# EasyEDA Pro project ProDoc_ChisFlash-MBC5-MAX-v1.22-R0603_32M..epro

# Schematic ChisFlash-MBC5-MAX-v1.22-0603电阻版
Board Name: ChisFlash-MBC5-MAX-v1.22-0603电阻; Create Date: 2025-04-26; Page Name: 1; Project Name: ChisFlash-MBC5（GBC烧录卡）2; Schematic Name: ChisFlash-MBC5-MAX-v1.22_1; Update Date: 2025-06-14; Company: 嘉立创EDA; Page Size: A4; Version: V1.0
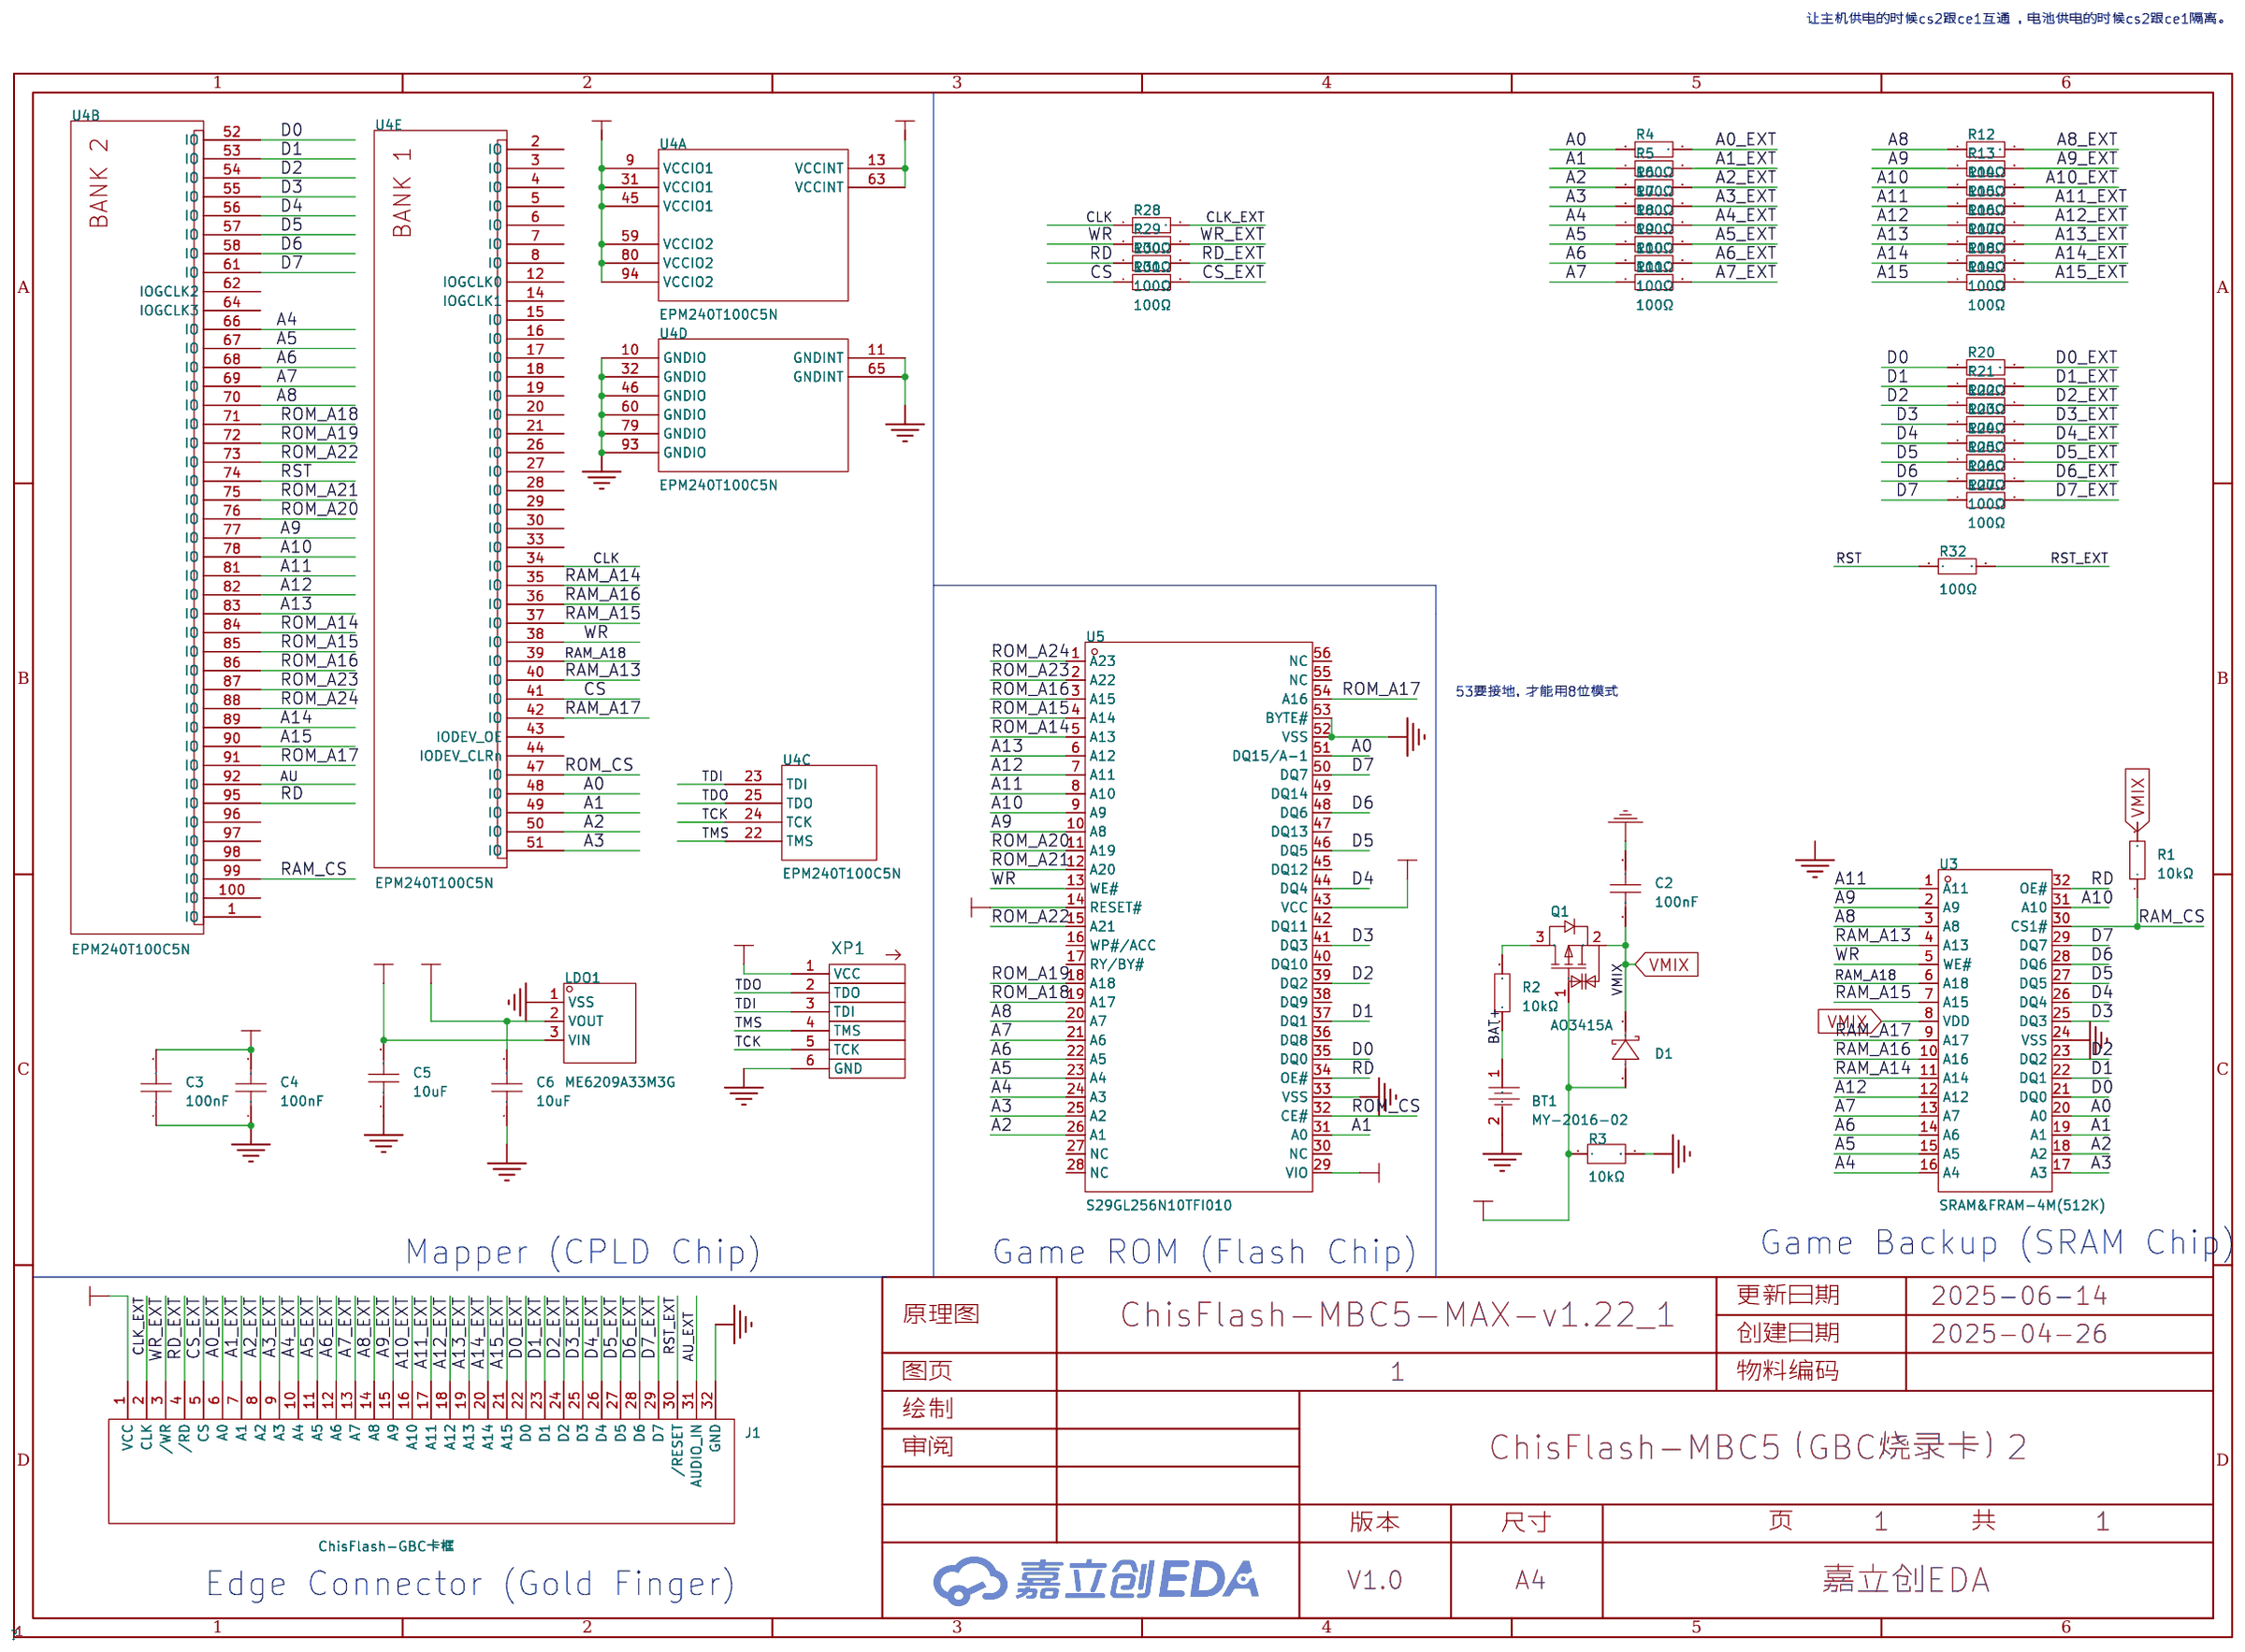
[diagram p0: schematic sheet]

## Parts
BT1  MY-2016-02  [BAT-SMD_MY-2032-08]
C2  100nF  [C0603]
C3  100nF  [C0603]
C4  100nF  [C0603]
C5  10uF  [C0603]
C6  10uF  [C0603]
D1  RB751V-40  [SOD-323_L1.7-W1.3-LS2.6-RD-1]
J1  ChisFlash-GBC卡框  [ChisFlash-GBC卡框]
LDO1  ME6209A33M3G  [SOT-23-3_L2.9-W1.6-P1.90-LS2.8-BR]
Q1  AO3415A  [SOT-23-3_L3.0-W1.7-P0.95-LS2.9-BR]
R1  10kΩ  [R0603]
R2  10kΩ  [R0603]
R3  10kΩ  [R0603]
R4  100Ω  [R01005]
R5  100Ω  [R01005]
R6  100Ω  [R01005]
R7  100Ω  [R01005]
R8  100Ω  [R01005]
R9  100Ω  [R01005]
R10  100Ω  [R01005]
R11  100Ω  [R01005]
R12  100Ω  [R01005]
R13  100Ω  [R01005]
R14  100Ω  [R01005]
R15  100Ω  [R01005]
R16  100Ω  [R01005]
R17  100Ω  [R01005]
R18  100Ω  [R01005]
R19  100Ω  [R01005]
R20  100Ω  [R01005]
R21  100Ω  [R01005]
R22  100Ω  [R01005]
R23  100Ω  [R01005]
R24  100Ω  [R01005]
R25  100Ω  [R01005]
R26  100Ω  [R01005]
R27  100Ω  [R01005]
R28  100Ω  [R01005]
R29  100Ω  [R01005]
R30  100Ω  [R01005]
R31  100Ω  [R01005]
R32  100Ω  [R01005]
U3  SRAM&FRAM-4M(512K)  [TSSOP-TSOP二合一_1]
U4  EPM240T100C5N  [TQFP-100_L14.0-W14.0-P0.50-LS16.0-BL]  (sections 1,2,3,4,5)
U5  S29GL256N10TFI010  [TSOP-56_L18.4-W14.0-P0.50-LS20.0-TL]
XP1  JTAG  [HDR-TH_6P-P1.27-V-M-1]  (no BOM)

## Library data of the parts
BT1 = MY-2016-02: 连接器类型:电池扣;适用电池规格:CR2016;触头材质:磷青铜;触点电镀:镍;工作温度范围:-25℃~+85℃;; LCSC Part Name: 电池扣 适用电池:CR2016; Supplier Part: C2979176; Manufacturer: MYOUNG(美阳); Supplier Footprint: SMD; JLCPCB Part Class: Extended Part; Datasheet: https://atta.szlcsc.com/upload/public/pdf/source/20220302/E5D3505CBEA02A6D68587A503653AA7C.pdf; Supplier: LCSC; Connector Type: 电池扣; Battery Type: CR2016; Contact Material: 磷青铜; Contact Plating: 镍; Operating Temperature Range: -25℃~+85℃
C2-C4 = CGA0603X7R104K500JT: 容值:100nF;精度:±10%;额定电压:50V;材质(温度系数):X7R;; LCSC Part Name: 100nF ±10% 50V; Supplier Part: C6119867; Manufacturer: HRE(芯声); Supplier Footprint: 0603; JLCPCB Part Class: Extended Part; Supplier: LCSC; Tolerance: ±10%; Voltage Rated: 50V; Temperature Coefficient: X7R
C5 C6 = CL10A106MA8NRNC: 容值:10uF;精度:±20%;额定电压:25V;材质(温度系数):X5R;; LCSC Part Name: 10uF ±20% 25V; Supplier Part: C96446; Manufacturer: SAMSUNG(三星); Supplier Footprint: 0603; JLCPCB Part Class: 基础库; Datasheet: https://atta.szlcsc.com/upload/public/pdf/source/20160218/1457707763339.pdf; Supplier: LCSC; Tolerance: ±20%; Voltage Rated: 25V; Temperature Coefficient: X5R
D1 = RB751V-40_C7502691: 二极管配置:独立式;正向压降(Vf):370mV@1mA;直流反向耐压(Vr):40V;平均整流电流(Io):30mA;; LCSC Part Name: 电压:40V 电流:30mA; Supplier Part: C7502691; Manufacturer: 宏迦橙; Supplier Footprint: SOD-323; JLCPCB Part Class: Extended Part; Datasheet: https://atta.szlcsc.com/upload/public/pdf/source/20230828/92E6C0C5321000DDFDA2BB61EC3C00B5.pdf; Supplier: LCSC; Diode Configuration: 独立式; Forward Voltage (Vf@If): 370mV@1mA; Reverse Voltage (Vr): 40V; Average Rectified Current (Io): 30mA; Reverse Leakage Current (Ir): 500nA; Peak forward surge current: 200mA
J1 = ChisFlash-GBC卡框
LDO1 = ME6209A33M3G: 输出类型:固定;最大输入电压:18V;输出电压:3.3V;最大输出电流:250mA;电源纹波抑制比(PSRR):-;输出极性:正极;; LCSC Part Name: 输入18V 输出3.3V 250mA; Supplier Part: C83508; Manufacturer: MICRONE(南京微盟); Supplier Footprint: SOT-23-3L; JLCPCB Part Class: 扩展库; Datasheet: https://atta.szlcsc.com/upload/public/pdf/source/20161212/1481539101152.pdf; Supplier: LCSC; Output Type: 固定; Maximum Input Voltage: 18V; Output Voltage: 3.3V; MAX Output Current: 250mA; Dropout Voltage: 80mV@(40mA); Output Polarity: 正极; Number of Outputs: 1
Q1 = AO3415A_C347479: 类型:P沟道;漏源电压(Vdss):20V;连续漏极电流(Id):4A;功率(Pd):350mW;导通电阻(RDS(on)@Vgs,Id):50mΩ@4.5V,4A;阈值电压(Vgs(th)@Id):1V@250uA;; LCSC Part Name: P沟道 耐压:20V 电流:4A; Supplier Part: C347479; Manufacturer: UMW(友台半导体); Supplier Footprint: SOT-23; JLCPCB Part Class: 扩展库; Datasheet: https://atta.szlcsc.com/upload/public/pdf/source/20231109/CCE52C768C334A854304A623E33B204A.pdf; Supplier: LCSC; Type: P沟道; Drain Source Voltage (Vdss): 20V; Continuous Drain Current (Id): 4A; Power Dissipation (Pd): 350mW; Drain Source On Resistance (RDS(on)@Vgs,Id): 50mΩ@4.5V,4A; Gate Threshold Voltage (Vgs(th)@Id): 1V@250uA
R1 R2 = 0603WAF1002T5E: 电阻类型:厚膜电阻;阻值:10kΩ;精度:±1%;功率:100mW;温度系数:±100ppm/℃;最大工作电压:75V;工作温度范围:-55℃~+155℃;; LCSC Part Name: 10kΩ ±1% 100mW; Supplier Part: C25804; Manufacturer: UNI-ROYAL(厚声); Supplier Footprint: 0603; JLCPCB Part Class: Basic Part; Datasheet: https://atta.szlcsc.com/upload/public/pdf/source/20200306/C422600_1E6D84923E4A46A82E41ADD87F860B5C.pdf; Supplier: LCSC; Type: 厚膜电阻; Tolerance: ±1%; Power(Watts): 100mW; Temperature Coefficient: ±100ppm/℃; Overload Voltage (Max): 75V; Operating Temperature Range: -55℃~+155℃; Resistance: 47K
R3 = RT0603BRD1010KL: 电阻类型:薄膜电阻;阻值:10kΩ;精度:±0.1%;功率:100mW;最大工作电压:75V;温度系数:±25ppm/℃;; LCSC Part Name: 薄膜电阻 10kΩ ±0.1% 100mW; Supplier Part: C2087321; Manufacturer: YAGEO(国巨); Supplier Footprint: 0603; JLCPCB Part Class: 扩展库; Datasheet: https://atta.szlcsc.com/upload/public/pdf/source/20200610/C326738_5639A9F1B6EB6E4AE2197577D3456E7F.pdf; Supplier: LCSC; Type: 薄膜电阻; Tolerance: ±0.1%; Power(Watts): 100mW; Overload Voltage (Max): 75V; Temperature Coefficient: ±25ppm/℃; Operating Temperature Range: -55℃~+155℃
R4-R32 = 0105WHJ0101TDE: 电阻类型:厚膜电阻;阻值:100Ω;精度:±5%;功率:31.25mW;最大工作电压:15V;温度系数:±400ppm/℃;; LCSC Part Name: 厚膜电阻 100Ω 31.25mW ±5%; Supplier Part: C270299; Manufacturer: UNI-ROYAL(厚声); Supplier Footprint: 01005; JLCPCB Part Class: Extended Part; Datasheet: https://atta.szlcsc.com/upload/public/pdf/source/20200306/C422600_1E6D84923E4A46A82E41ADD87F860B5C.pdf; Supplier: LCSC; Type: 厚膜电阻; Tolerance: ±5%; Power(Watts): 31.25mW; Overload Voltage (Max): 15V; Temperature Coefficient: ±400ppm/℃; Operating Temperature Range: -55℃~+125℃
U3 = SRAM&FRAM-4M(512K)
U4 = EPM240T100C5N: 类型:其它PLD;逻辑门数量:-;逻辑单元数:-;逻辑阵列块数:240;; Supplier Part: C10041; Manufacturer: Intel/Altera; Supplier Footprint: TQFP-100(14x14); JLCPCB Part Class: 扩展库; Datasheet: https://atta.szlcsc.com/upload/public/pdf/source/20121123/1457706563537.pdf; Supplier: LCSC; Type: 其它PLD; Supply Voltage Range - VCCIO: 3.3V；2.5V; Logic Array Blocks: 240; Maximum Delay Time Tpd: 4.7ns; Operating Temperature Range: 0℃~+85℃
U5 = S29GL256N10TFI010: Supplier Part: C1349323; Supplier Footprint: TSOP-56-14.0mm; JLCPCB Part Class: 扩展库; Supplier: LCSC
XP1 = jtag

## Nets
+3V3: C3.2 C4.2 C6.2 D1.2(A) LDO1.2(VOUT) Q1.1(G) R3.1 U4.9(VCCIO1) U4.13(VCCINT) U4.31(VCCIO1) U4.45(VCCIO1) U4.59(VCCIO2) U4.63(VCCINT) U4.80(VCCIO2) U4.94(VCCIO2) U5.14(RESET#) U5.29(VIO) U5.43(VCC) XP1.1(VCC)
+5V: C5.2 J1.1(VCC) LDO1.3(VIN)
GND: BT1.2 C2.1 C3.1 C4.1 C5.1 C6.1 J1.32(GND) LDO1.1(VSS) R3.2 U3.24(VSS) U4.10(GNDIO) U4.11(GNDINT) U4.32(GNDIO) U4.46(GNDIO) U4.60(GNDIO) U4.65(GNDINT) U4.79(GNDIO) U4.93(GNDIO) U5.33(VSS) U5.52(VSS) U5.53(BYTE#) XP1.6(GND)
A0: R4.1 U3.20(A0) U4.48(IO) U5.51(DQ15/A-1)
A0_EXT: J1.6(A0) R4.2
A1: R5.1 U3.19(A1) U4.49(IO) U5.31(A0)
A1_EXT: J1.7(A1) R5.2
A2: R6.1 U3.18(A2) U4.50(IO) U5.26(A1)
A2_EXT: J1.8(A2) R6.2
A3: R7.1 U3.17(A3) U4.51(IO) U5.25(A2)
A3_EXT: J1.9(A3) R7.2
A4: R8.1 U3.16(A4) U4.66(IO) U5.24(A3)
A4_EXT: J1.10(A4) R8.2
A5: R9.1 U3.15(A5) U4.67(IO) U5.23(A4)
A5_EXT: J1.11(A5) R9.2
A6: R10.1 U3.14(A6) U4.68(IO) U5.22(A5)
A6_EXT: J1.12(A6) R10.2
A7: R11.1 U3.13(A7) U4.69(IO) U5.21(A6)
A7_EXT: J1.13(A7) R11.2
A8: R12.1 U3.3(A8) U4.70(IO) U5.20(A7)
A8_EXT: J1.14(A8) R12.2
A9: R13.1 U3.2(A9) U4.77(IO) U5.10(A8)
A9_EXT: J1.15(A9) R13.2
A10: R14.1 U3.31(A10) U4.78(IO) U5.9(A9)
A10_EXT: J1.16(A10) R14.2
A11: R15.1 U3.1(A11) U4.81(IO) U5.8(A10)
A11_EXT: J1.17(A11) R15.2
A12: R16.1 U3.12(A12) U4.82(IO) U5.7(A11)
A12_EXT: J1.18(A12) R16.2
A13: R17.1 U4.83(IO) U5.6(A12)
A13_EXT: J1.19(A13) R17.2
A14: R18.1 U4.89(IO)
A14_EXT: J1.20(A14) R18.2
A15: R19.1 U4.90(IO)
A15_EXT: J1.21(A15) R19.2
AU: U4.92(IO)
AU_EXT: J1.31(AUDIO_IN)
BAT+: BT1.1 R2.1
BATQ1: Q1.3(D) R2.2
CLK: R28.1 U4.34(IO)
CLK_EXT: J1.2(CLK) R28.2
CS: R31.1 U4.41(IO)
CS_EXT: J1.5(CS) R31.2
D0: R20.1 U3.21(DQ0) U4.52(IO) U5.35(DQ0)
D0_EXT: J1.22(D0) R20.2
D1: R21.1 U3.22(DQ1) U4.53(IO) U5.37(DQ1)
D1_EXT: J1.23(D1) R21.2
D2: R22.1 U3.23(DQ2) U4.54(IO) U5.39(DQ2)
D2_EXT: J1.24(D2) R22.2
D3: R23.1 U3.25(DQ3) U4.55(IO) U5.41(DQ3)
D3_EXT: J1.25(D3) R23.2
D4: R24.1 U3.26(DQ4) U4.56(IO) U5.44(DQ4)
D4_EXT: J1.26(D4) R24.2
D5: R25.1 U3.27(DQ5) U4.57(IO) U5.46(DQ5)
D5_EXT: J1.27(D5) R25.2
D6: R26.1 U3.28(DQ6) U4.58(IO) U5.48(DQ6)
D6_EXT: J1.28(D6) R26.2
D7: R27.1 U3.29(DQ7) U4.61(IO) U5.50(DQ7)
D7_EXT: J1.29(D7) R27.2
RAM_A13: U3.4(A13) U4.40(IO)
RAM_A14: U3.11(A14) U4.35(IO)
RAM_A15: U3.7(A15) U4.37(IO)
RAM_A16: U3.10(A16) U4.36(IO)
RAM_A17: U3.9(A17) U4.42(IO)
RAM_A18: U3.6(A18) U4.39(IO)
RAM_CS: R1.1 U3.30(CS1#) U4.99(IO)
RD: R30.1 U3.32(OE#) U4.95(IO) U5.34(OE#)
RD_EXT: J1.4(/RD) R30.2
ROM_A14: U4.84(IO) U5.5(A13)
ROM_A15: U4.85(IO) U5.4(A14)
ROM_A16: U4.86(IO) U5.3(A15)
ROM_A17: U4.91(IO) U5.54(A16)
ROM_A18: U4.71(IO) U5.19(A17)
ROM_A19: U4.72(IO) U5.18(A18)
ROM_A20: U4.76(IO) U5.11(A19)
ROM_A21: U4.75(IO) U5.12(A20)
ROM_A22: U4.73(IO) U5.15(A21)
ROM_A23: U4.87(IO) U5.2(A22)
ROM_A24: U4.88(IO) U5.1(A23)
ROM_CS: U4.47(IO) U5.32(CE#)
RST: R32.1 U4.74(IO)
RST_EXT: J1.30(/RESET) R32.2
TCK: U4.24(TCK) XP1.5(TCK)
TDI: U4.23(TDI) XP1.3(TDI)
TDO: U4.25(TDO) XP1.2(TDO)
TMS: U4.22(TMS) XP1.4(TMS)
VMIX: C2.2 D1.1(K) Q1.2(S) R1.2 U3.8(VDD)
WR: R29.1 U3.5(WE#) U4.38(IO) U5.13(WE#)
WR_EXT: J1.3(/WR) R29.2

Not connected (* = marked no-connect by the designer): U4 1(IO) 2(IO) 3(IO) 4(IO) 5(IO) 6(IO) 7(IO) 8(IO) 12(IOGCLK0) 14(IOGCLK1) 15(IO) 16(IO) 17(IO) 18(IO) 19(IO) 20(IO) 21(IO) 26(IO) 27(IO) 28(IO) 29(IO) 30(IO) 33(IO) 43(IODEV_OE) 44(IODEV_CLRn) 62(IOGCLK2) 64(IOGCLK3) 96(IO) 97(IO) 98(IO) 100(IO); U5 16(WP#/ACC) 17(RY/BY#) 27(NC) 28(NC) 30(NC) 36(DQ8) 38(DQ9) 40(DQ10) 42(DQ11) 45(DQ12) 47(DQ13) 49(DQ14) 55(NC) 56(NC)

## Notes on the sheet
- 让主机供电的时候cs2跟ce1互通 ，电池供电的时候cs2跟ce1隔离。
- 53要接地，才能用8位模式
- Game Backup (SRAM Chip)
- Mapper (CPLD Chip)
- Game ROM (Flash Chip)
- Edge Connector (Gold Finger)

# Board ChisFlash-MBC5-MAX-v1.22-0603电阻版
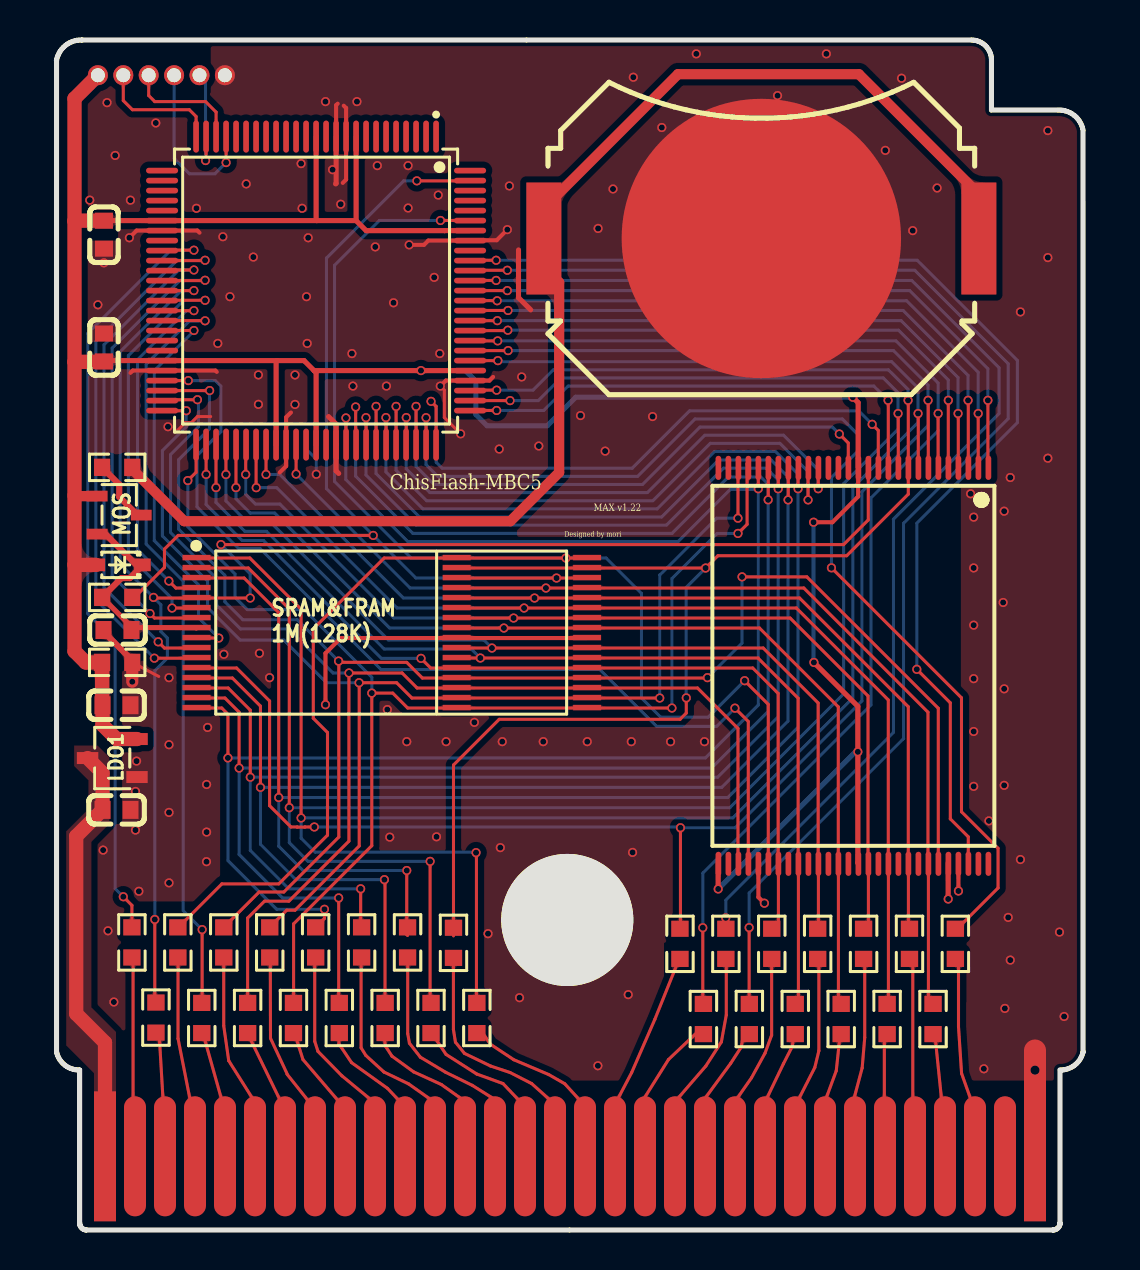
[diagram p1: board, top side]
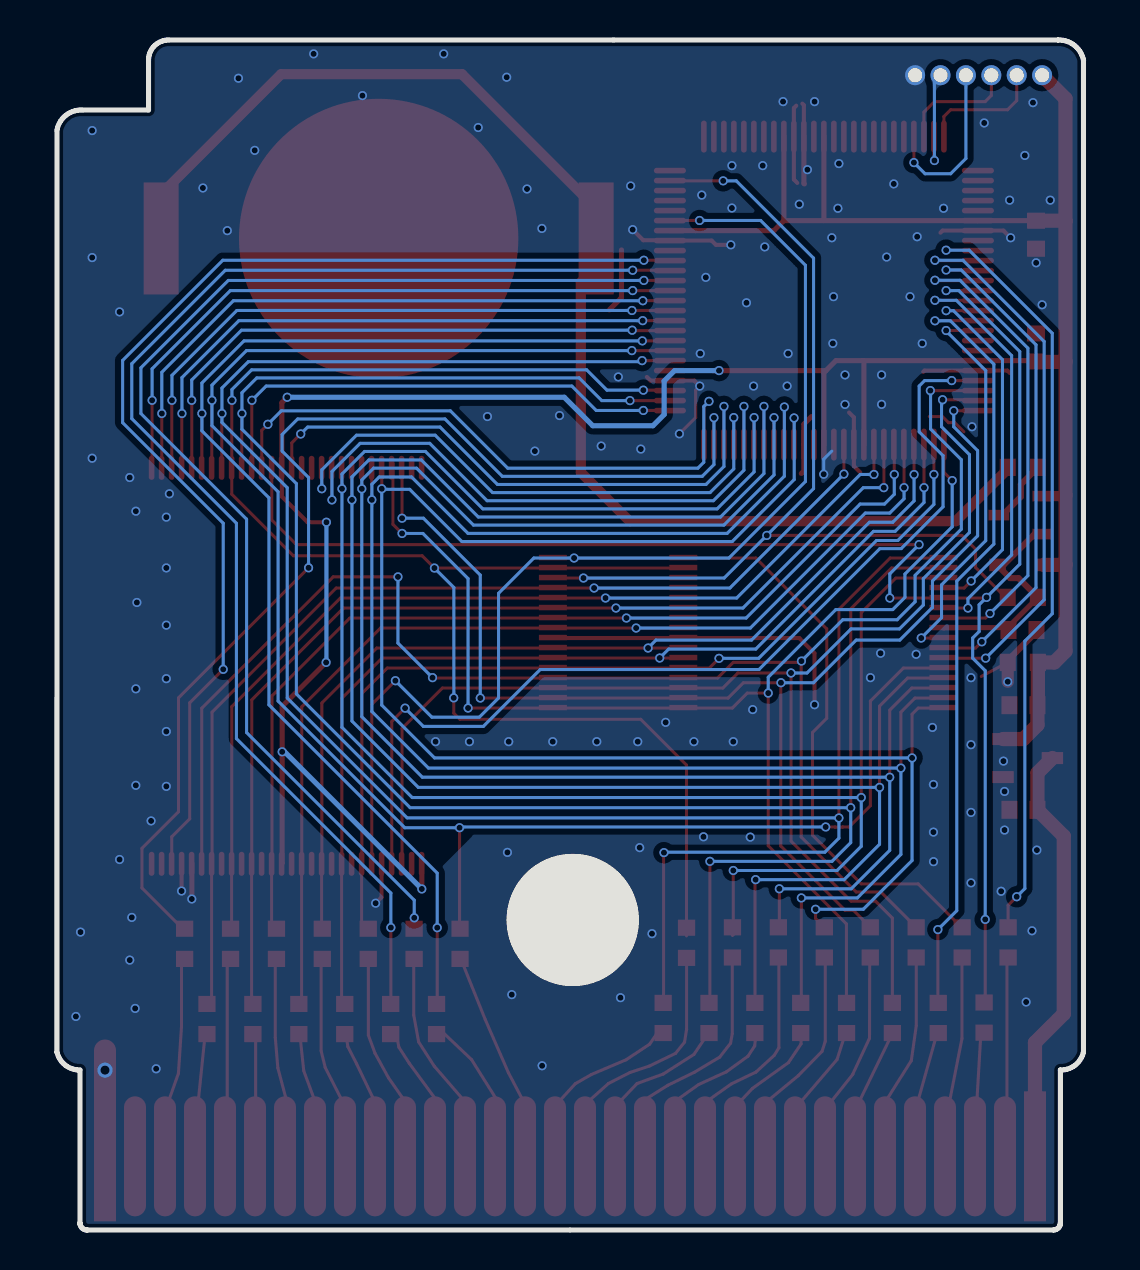
[diagram p2: board, bottom side, seen from below]

Outline 51.33 x 59.5 mm; copper layers: Top Layer, Bottom Layer. Coordinates in mm from the lower left corner of the outline.
Stack: Top Layer 0.035mm / Dielectric1 1.51mm FR4 er 4.5 / Bottom Layer 0.035mm

## Design rules (mm)
template: 自定义配置
spacing copperThickness1oz (default): track to track 0.254, other pairs 0.152 to 0.152
spacing copperThickness2oz: track to track 0.203, other pairs 0.152 to 0.3
track width copperThickness1oz (default): min 0.152, default 0.152, max 2.54
track width copperThickness2oz: min 0.203, default 0.254, max 2.54
differential pair differentialPair (default): width min 0.127, default 0.254, max 2.54; gap min 0.152, default 0.152
via viaSize (default): diameter min 0.457, default 0.457, max 10; hole min 0.3, default 0.305, max 6.299

## Placement (name value [footprint] x y rotation side)
BT1  MY-2016-02  [BAT-SMD_MY-2032-08]  35.24 49.58 180 top
C2  100nF  [C0603]  3.05 30 0 top
C3  100nF  [C0603]  2.38 49.77 90 top
C4  100nF  [C0603]  2.38 44.13 270 top
C5  10uF  [C0603]  3 21.01 180 top
C6  10uF  [C0603]  3 26.24 180 top
D1  RB751V-40  [SOD-323_L1.7-W1.3-LS2.6-RD-1]  3.16 33.26 180 top
J1  -  [ChisFlash-GBC卡框]  25.54 15.5 0 top
LDO1  ME6209A33M3G  [SOT-23-3_L2.9-W1.6-P1.90-LS2.8-BR]  2.79 23.6 0 top
Q1  AO3415A  [SOT-23-3_L3.0-W1.7-P0.95-LS2.9-BR]  3.14 35.75 180 top
R1  10kΩ  [R0603]  3.04 31.63 180 top
R2  10kΩ  [R0603]  3.04 38.13 180 top
R3  10kΩ  [R0603]  3.04 28.38 0 top
R4  100Ω  [R0603]  8.37 14.38 270 top
R5  100Ω  [R0603]  9.56 10.6 270 top
R6  100Ω  [R0603]  10.66 14.38 270 top
R7  100Ω  [R0603]  11.85 10.6 270 top
R8  100Ω  [R0603]  12.96 14.38 270 top
R9  100Ω  [R0603]  14.14 10.6 270 top
R10  100Ω  [R0603]  15.26 14.38 270 top
R11  100Ω  [R0603]  16.44 10.6 270 top
R12  100Ω  [R0603]  17.55 14.38 270 top
R13  100Ω  [R0603]  18.73 10.6 270 top
R14  100Ω  [R0603]  19.85 14.36 270 top
R15  100Ω  [R0603]  21.02 10.6 270 top
R16  100Ω  [R0603]  31.17 14.31 270 top
R17  100Ω  [R0603]  32.35 10.55 270 top
R18  100Ω  [R0603]  33.47 14.31 270 top
R19  100Ω  [R0603]  34.64 10.55 270 top
R20  100Ω  [R0603]  35.77 14.31 270 top
R21  100Ω  [R0603]  36.94 10.55 270 top
R22  100Ω  [R0603]  38.06 14.31 270 top
R23  100Ω  [R0603]  39.24 10.55 270 top
R24  100Ω  [R0603]  40.36 14.31 270 top
R25  100Ω  [R0603]  41.53 10.55 270 top
R26  100Ω  [R0603]  42.65 14.31 270 top
R27  100Ω  [R0603]  43.83 10.55 270 top
R28  100Ω  [R0603]  3.77 14.38 270 top
R29  100Ω  [R0603]  4.97 10.62 270 top
R30  100Ω  [R0603]  6.07 14.38 270 top
R31  100Ω  [R0603]  7.27 10.6 270 top
R32  100Ω  [R0603]  44.95 14.31 270 top
U3  SRAM&FRAM-4M(512K)  [TSSOP-TSOP二合一_1]  17.77 29.85 180 top
U4  EPM240T100C5N  [TQFP-100_L14.0-W14.0-P0.50-LS16.0-BL]  12.98 46.97 180 top
U5  S29GL256N10TFI010  [TSOP-56_L18.4-W14.0-P0.50-LS20.0-TL]  39.85 28.21 270 top
XP1  JTAG  [HDR-TH_6P-P1.27-V-M-1]  5.25 57.74 0 top

## Footprints (pads in the part's own frame, mm; a bottom-side part is the same pattern mirrored in y, then rotated)
BAT-SMD_MY-2032-08
  rect 1.75x5.6 smd: 1(-10.875,0) 1(10.875,0)
  round 13.97 smd: 2(0,0)
C0603
  rect 0.8x0.9 smd: 1(-0.7,0) 2(0.7,0)
ChisFlash-GBC卡框
  round 6.604 hole 6.604x6.223: 0(0,0)
  rect 1.1x6.5 smd: 1(-23.114,-11.819) 32(23.386,-11.819)
  oval 1.1x6 smd: 2(-21.614,-11.819) 3(-20.114,-11.819) 4(-18.614,-11.819) 5(-17.114,-11.819) 6(-15.614,-11.819) 7(-14.114,-11.819) 8(-12.614,-11.819) 9(-11.114,-11.819) 10(-9.614,-11.819) 11(-8.114,-11.819) 12(-6.614,-11.819) 13(-5.114,-11.819) 14(-3.614,-11.819) 15(-2.114,-11.819) 16(-0.614,-11.819) 17(0.886,-11.819) 18(2.386,-11.819) 19(3.886,-11.819) 20(5.386,-11.819) 21(6.886,-11.819) 22(8.386,-11.819) 23(9.886,-11.819) 24(11.386,-11.819) 25(12.886,-11.819) 26(14.386,-11.819) 27(15.886,-11.819) 28(17.386,-11.819) 29(18.886,-11.819) 30(20.386,-11.819) 31(21.886,-11.819)
HDR-TH_6P-P1.27-V-M-1
  round 1 hole 0.7: 1(-3.175,0) 2(-1.905,0) 3(-0.635,0) 4(0.635,0) 5(1.905,0) 6(3.175,0)
R0603
  rect 0.806x0.864 smd: 1(-0.753,0) 2(0.753,0)
SOD-323_L1.7-W1.3-LS2.6-RD-1
  rect 0.83x0.63 smd: 1(-1.14,0) 2(1.14,0)
SOT-23-3_L2.9-W1.6-P1.90-LS2.8-BR
  rect 1.07x0.6 smd: 1(1.235,-0.95) 2(1.235,0.95) 3(-1.235,0)
SOT-23-3_L3.0-W1.7-P0.95-LS2.9-BR
  rect 1.038x0.532 smd: 1(1.101,-0.95) 2(1.101,0.95) 3(-1.101,0)
TQFP-100_L14.0-W14.0-P0.50-LS16.0-BL
  oval 0.28x1.6 smd: 1(-6,-7.7) 2(-5.5,-7.7) 3(-5,-7.7) 4(-4.5,-7.7) 5(-4,-7.7) 6(-3.5,-7.7) 7(-3,-7.7) 8(-2.5,-7.7) 9(-2,-7.7) 10(-1.5,-7.7) 11(-1,-7.7) 12(-0.5,-7.7) 13(0,-7.7) 14(0.5,-7.7) 15(1,-7.7) 16(1.5,-7.7) 17(2,-7.7) 18(2.5,-7.7) 19(3,-7.7) 20(3.5,-7.7) 21(4,-7.7) 22(4.5,-7.7) 23(5,-7.7) 24(5.5,-7.7) 25(6,-7.7) 51(6,7.7) 52(5.5,7.7) 53(5,7.7) 54(4.5,7.7) 55(4,7.7) 56(3.5,7.7) 57(3,7.7) 58(2.5,7.7) 59(2,7.7) 60(1.5,7.7) 61(1,7.7) 62(0.5,7.7) 63(0,7.7) 64(-0.5,7.7) 65(-1,7.7) 66(-1.5,7.7) 67(-2,7.7) 68(-2.5,7.7) 69(-3,7.7) 70(-3.5,7.7) 71(-4,7.7) 72(-4.5,7.7) 73(-5,7.7) 74(-5.5,7.7) 75(-6,7.7)
  oval 1.6x0.28 smd: 26(7.7,-6) 27(7.7,-5.5) 28(7.7,-5) 29(7.7,-4.5) 30(7.7,-4) 31(7.7,-3.5) 32(7.7,-3) 33(7.7,-2.5) 34(7.7,-2) 35(7.7,-1.5) 36(7.7,-1) 37(7.7,-0.5) 38(7.7,0) 39(7.7,0.5) 40(7.7,1) 41(7.7,1.5) 42(7.7,2) 43(7.7,2.5) 44(7.7,3) 45(7.7,3.5) 46(7.7,4) 47(7.7,4.5) 48(7.7,5) 49(7.7,5.5) 50(7.7,6) 76(-7.7,6) 77(-7.7,5.5) 78(-7.7,5) 79(-7.7,4.5) 80(-7.7,4) 81(-7.7,3.5) 82(-7.7,3) 83(-7.7,2.5) 84(-7.7,2) 85(-7.7,1.5) 86(-7.7,1) 87(-7.7,0.5) 88(-7.7,0) 89(-7.7,-0.5) 90(-7.7,-1) 91(-7.7,-1.5) 92(-7.7,-2) 93(-7.7,-2.5) 94(-7.7,-3) 95(-7.7,-3.5) 96(-7.7,-4) 97(-7.7,-4.5) 98(-7.7,-5) 99(-7.7,-5.5) 100(-7.7,-6)
TSOP-56_L18.4-W14.0-P0.50-LS20.0-TL
  oval 1.2x0.28 smd: 1(-9.9,6.75) 2(-9.9,6.25) 3(-9.9,5.75) 4(-9.9,5.25) 5(-9.9,4.75) 6(-9.9,4.25) 7(-9.9,3.75) 8(-9.9,3.25) 9(-9.9,2.75) 10(-9.9,2.25) 11(-9.9,1.75) 12(-9.9,1.25) 13(-9.9,0.75) 14(-9.9,0.25) 15(-9.9,-0.25) 16(-9.9,-0.75) 17(-9.9,-1.25) 18(-9.9,-1.75) 19(-9.9,-2.25) 20(-9.9,-2.75) 21(-9.9,-3.25) 22(-9.9,-3.75) 23(-9.9,-4.25) 24(-9.9,-4.75) 25(-9.9,-5.25) 26(-9.9,-5.75) 27(-9.9,-6.25) 28(-9.9,-6.75) 29(9.9,-6.75) 30(9.9,-6.25) 31(9.9,-5.75) 32(9.9,-5.25) 33(9.9,-4.75) 34(9.9,-4.25) 35(9.9,-3.75) 36(9.9,-3.25) 37(9.9,-2.75) 38(9.9,-2.25) 39(9.9,-1.75) 40(9.9,-1.25) 41(9.9,-0.75) 42(9.9,-0.25) 43(9.9,0.25) 44(9.9,0.75) 45(9.9,1.25) 46(9.9,1.75) 47(9.9,2.25) 48(9.9,2.75) 49(9.9,3.25) 50(9.9,3.75) 51(9.9,4.25) 52(9.9,4.75) 53(9.9,5.25) 54(9.9,5.75) 55(9.9,6.25) 56(9.9,6.75)
TSSOP-TSOP二合一_1
  rect 1.399x0.27 smd: 1(10.762,-3.769) 2(10.762,-3.269) 3(10.762,-2.769) 4(10.762,-2.269) 5(10.762,-1.769) 6(10.762,-1.269) 7(10.762,-0.769) 8(10.762,-0.269) 9(10.762,0.231) 10(10.762,0.731) 11(10.762,1.231) 12(10.762,1.731) 13(10.762,2.231) 14(10.762,2.731) 15(10.762,3.231) 16(10.762,3.731) 17(-8.763,3.731) 17(-2.243,3.731) 18(-8.763,3.231) 18(-2.243,3.231) 19(-8.763,2.731) 19(-2.243,2.731) 20(-8.763,2.231) 20(-2.243,2.231) 21(-8.763,1.731) 21(-2.243,1.731) 22(-8.763,1.231) 22(-2.243,1.231) 23(-8.763,0.731) 23(-2.243,0.731) 24(-8.763,0.231) 24(-2.243,0.231) 25(-8.763,-0.269) 25(-2.243,-0.269) 26(-8.763,-0.769) 26(-2.243,-0.769) 27(-8.763,-1.269) 27(-2.243,-1.269) 28(-8.763,-1.769) 28(-2.243,-1.769) 29(-8.763,-2.269) 29(-2.243,-2.269) 30(-8.763,-2.769) 30(-2.243,-2.769) 31(-8.763,-3.269) 31(-2.243,-3.269) 32(-8.763,-3.769) 32(-2.243,-3.769)

## Nets
As in the schematic, except:
GND: BT1.2 C2.1 C3.1 C4.1 C5.1 C6.1 J1.0 J1.32 LDO1.1 R3.2 U3.24 U4.10 U4.11 U4.32 U4.46 U4.60 U4.65 U4.79 U4.93 U5.33 U5.52 U5.53 XP1.6

Pads without a net: U4 1 2 3 4 5 6 7 8 12 14 15 16 17 18 19 20 21 26 27 28 29 30 33 43 44 62 64 96 97 98 100; U5 16 17 27 28 30 36 38 40 42 45 47 49 55 56

## Via types
v1: diameter 0.457, hole 0.305, Top Layer to Bottom Layer, 261 vias
v2: diameter 0.762, hole 0.457, Top Layer to Bottom Layer, 1 via

## Routing (per net, layer and track width the routed paths; a pad name or vN(x,y) marks a point on that pad's centre or on a via; arc(x,y) is an arc through that point)
+3V3: length 155.9
  Top Layer w0.203: v1(37.86,35.39) 38.8,35.39 40.08,36.68 40.08,38.15
  Top Layer w0.254: 11.02,43.47 U4.45 2.44,43.47 2.38,43.41 ; 11.02,43.47 12.38,43.47 12.88,42.97 ; 11.02,43.47 10.98,43.43 U4.59 ; U4.80 v1(18.22,42.97) 12.88,42.97 ; 14.98,50.47 15.48,49.97 19.41,49.97 19.41,49.97 U4.94 ; 14.98,50.47 13.02,50.47 ; 14.98,50.47 U4.9 ; C3.2 2.38,50.47 U4.31 13.02,50.47 ; 33.09,18.34 v1(33.09,17.05) ; 13.02,50.47 12.98,50.51 U4.13 ; 12.88,42.97 12.98,42.87 U4.63 ; 40.08,18.34 40.07,18.36 v1(40.07,23.91) 40.07,26.18 v1(37.87,28.38) ; 40.08,38.15 40.08,41.37 v1(39.82,41.64)
  Top Layer w0.508: 0.9,36.73 0.93,36.7 Q1.1
  Top Layer w0.711: 0.9,50.45 0.92,50.47 C3.2 ; 0.9,50.45 0.9,43.42 ; 0.9,50.45 0.9,56.57 XP1.1 ; LDO1.2 3.01,24.55 2.3,25.25 C6.2 2.28,26.26 R3.1 1.46,28.38 0.9,28.94 0.9,33.26 ; 2.38,43.41 0.91,43.41 0.9,43.42 ; 0.9,43.42 0.9,33.26 ; 0.9,33.26 1.98,33.26
  Bottom Layer w0.203: v1(37.87,28.38) 37.86,28.4 v1(37.86,35.39)
  Bottom Layer w0.254: v1(40.07,23.91) 39.94,23.91 v1(33.09,17.05) ; v1(39.82,41.64) 25.96,41.64 24.54,40.22 21.53,40.22 20.97,40.78 20.97,42.45 20.45,42.97 v1(18.22,42.97)
+5V: length 21.4
  Top Layer w0.711: J1.1 2.43,9.37 0.99,10.81 0.99,19.69 C5.2 2.3,22.85 LDO1.3
GND: length 71
  Top Layer w0.152: 5.98,39.91 6.44,40.37 6.75,40.37 7.05,40.67 7.71,40.67 ; v1(19.19,42.2) 19.39,41.99 19.39,40.62 v1(20.21,39.81) ; 3.81,27.44 v1(3.79,27.42) ; 3.84,28.35 5.11,27.68
  Top Layer w0.203: 22.45,50.08 22.51,50.02 v1(22.54,50.02) 22.01,49.49 20.7,49.49 U4.93 18.59,49.47 18.38,49.26 v1(17.64,49.26) ; U4.11 13.98,56.24 14.06,56.32 ; 11.16,37.88 11.48,38.2 U4.60 11.48,40.64 11.72,40.88 ; 35.1,18.31 35.1,16.64 v1(35.4,16.34) ; 14.37,56.22 14.48,56.1 U4.10 14.48,52.53 14.31,52.36 ; v1(3.65,49.61) 4,49.97 U4.32 7.05,49.97 7.15,49.87 ; 8.01,42.91 7.95,42.97 U4.46 3.81,42.97 3.7,42.86 ; v1(13.45,26.27) 13.45,28.84 14.21,29.6 26.52,29.6 ; v1(19.19,42.2) 19.47,42.47 U4.79 21.65,42.47 21.83,42.66 ; 45.1,18.31 45.1,16.95
  Top Layer w0.254: 14.11,37.83 13.98,37.96 U4.65 13.98,40.29 13.6,40.67 ; 23.1,49.01 23.1,46.62 23.71,46.01 ; 13.96,52.31 13.98,52.33 U4.11 ; 44.59,18.34 44.59,16.55
  Top Layer w0.305: 3.79,28.56 3.71,28.56 2.35,29.92 C2.1
  Top Layer w0.61: R3.2 v1(3.79,27.42)
  Top Layer w1.1: 48.93,8.97 v2(48.93,7.99) J1.32
  Bottom Layer w0.152: v1(12.99,37.79) 12.99,38.54 12.59,38.95
  vias: v1(1.66,51.49) v1(2.07,46.26) v1(2.37,48.36) v1(2.33,19) v1(2.53,56.37) v1(2.58,14.96) v1(2.87,11.4) v1(2.94,53.73) v1(3.7,51.49) v1(3.95,21.93) v1(3.95,20) v1(4,23.45) v1(4.12,16.94) v1(4.97,55.36) v1(5.58,40.17) v1(5.63,27.62) v1(5.63,24.27) v1(5.63,20.88) v1(5.63,17.36) v1(7,51.09) v1(7.56,25.13) v1(7.51,22.28) v1(7.51,19.9) v1(7.5,18.42) v1(8.07,44.33) v1(8.32,49.67) v1(8.37,28.79) v1(8.68,46.67) v1(9.49,52.31) v1(9.84,48.65) v1(10.1,42.76) v1(10.1,41.28) v1(10.15,28.84) v1(10.66,27.62) v1(11.93,42.76) v1(11.93,41.28) v1(12.23,53.32) v1(12.28,51.09) v1(12.59,49.61) v1(12.5,46.67) v1(12.54,44.33) v1(13.45,56.42) v1(13.81,53.02) v1(14.21,51.29) v1(14.77,43.82) v1(14.82,42.2) v1(15.02,56.42) v1(15.94,49.16) v1(16.04,53.22) v1(16.5,42.2) v1(16.54,26.02) v1(16.66,19.64) v1(16.85,46.36) v1(17.58,53.22) v1(17.58,51.1) v1(17.51,24.42) v1(18.89,47.63) v1(19.09,51.75) v1(19,19.66) v1(19.16,43.82) v1(19.48,24.42) v1(20.89,25.38) v1(21.58,14.82) v1(22.14,39.05) v1(22.29,24.42) v1(22.19,19.12) v1(22.65,52.21) v1(23.15,11.62) v1(23.26,42.66) v1(24.12,39.2) v1(24.34,24.42) v1(26.2,40.72) v1(26.54,24.42) v1(27.08,50.08) v1(27.07,8.21) v1(27.43,38.95) v1(27.83,52.05) v1(28.59,11.77) v1(28.74,24.42) v1(28.84,57.64) v1(28.81,18.88) v1(29.81,40.67) v1(30.27,55.13) v1(30.71,24.42) v1(31.99,58.81) v1(32.4,24.42) v1(36.05,56.72) v1(38.5,58.81) v1(41.44,53.98) v1(42.25,57.59) v1(42.81,49.97) v1(44.03,52.1) v1(44.59,16.55) v1(45.1,16.95) v1(45.71,36.81) v1(45.86,35.64) v1(45.86,33.1) v1(45.86,30.24) v1(45.86,27.57) v1(45.86,24.93) v1(45.86,22.18) v1(46.37,8.06) v1(46.62,20.46) v1(47.38,35.94) v1(47.33,31.38) v1(47.38,27.06) v1(47.38,22.23) v1(47.42,11.08) v1(47.59,15.63) v1(47.69,37.63) v1(47.69,13.5) v1(48.2,45.91) v1(48.2,18.53) v1(49.57,54.97) v1(49.57,48.62) v1(49.57,38.59) v1(50.15,14.9) v1(50.38,10.68)
A0: length 82.5
  Top Layer w0.152: 14.12,28.38 14.12,28.43 v1(14.1,28.45) ; 14.12,28.38 17.51,28.38 18.3,27.6 32.53,27.6 v1(32.55,27.62) ; 14.12,28.38 14.12,19.65 11.37,16.9 10.13,16.9 R4.1 ; v1(34.28,32.66) 37.52,32.66 44.09,26.09 44.09,18.64 ; U4.48 v1(7.66,41.97)
  Bottom Layer w0.152: 7.65,42.06 7.65,40.05 6.11,38.52 6.11,35.04 8.42,32.73 8.42,31.41 9.32,30.51 12.04,30.51 v1(14.1,28.45) ; v1(32.55,27.62) 34.28,29.35 v1(34.28,32.66)
A0_EXT: length 7.5
  Top Layer w0.152: 9.86,6.48 8.61,8.47 8.36,10.22 8.36,13.62 R4.2
A1: length 67.7
  Top Layer w0.152: U4.49 5.32,41.52 v1(7.05,41.52) ; 9.56,11.66 9.56,15.6 10.4,16.44 11.62,16.44 14.62,19.44 14.62,27.85 v1(14.63,27.85) 17.28,27.85 18.03,27.1 32.05,27.1 34.08,25.08 34.08,18.65 34.09,18.64
  Bottom Layer w0.152: v1(14.63,27.85) 13.83,27.85 11.62,30.06 9.2,30.06 8.01,31.25 8.01,32.57 5.7,34.88 5.7,38.77 7.1,40.17 7.1,41.47 v1(7.05,41.52)
A1_EXT: length 3.9
  Top Layer w0.152: 11.18,6.5 9.49,9.97
A2: length 65
  Top Layer w0.152: U4.50 5.29,40.97 v1(6.49,40.97) ; v1(34.08,35.59) 34.08,38.36 34.09,38.38 ; v1(30.16,26.6) 17.77,26.6 17.01,27.36 v1(15.13,27.36) 15.14,27.36 15.14,19.2 11.93,15.99 11.51,15.99 10.88,15.36
  Bottom Layer w0.152: v1(34.08,35.59) 33.01,35.59 30.16,32.75 v1(30.16,26.6) ; v1(6.49,40.97) 6.49,40.17 5.3,38.97 5.3,34.71 7.55,32.45 7.55,31.13 9.19,29.5 11.37,29.5 13.5,27.36 v1(15.13,27.36)
A2_EXT: length 7.7
  Top Layer w0.152: 11.54,7.8 10.7,9.59 10.69,13.6 R6.2 ; 12.58,6.47 11.53,7.79
A3: length 64.7
  Top Layer w0.152: 34.59,38.38 34.53,38.32 34.53,35.29 v1(34.08,34.83) ; 11.85,11.66 11.86,11.66 11.86,15.31 15.77,19.22 v1(15.77,26.85) 16.81,26.85 17.56,26.1 v1(30.77,26.1) ; v1(6.57,37.47) 6.98,37.89 U4.51
  Bottom Layer w0.152: v1(6.57,37.47) 6.57,35.16 8.93,32.8 8.93,31.63 9.54,31.02 12.38,31.02 15.77,27.64 v1(15.77,26.85) ; v1(30.77,26.1) 30.77,32.57 33.03,34.83 v1(34.08,34.83)
A3_EXT: length 4.3
  Top Layer w0.152: 14.1,6.45 12.33,8.52 11.84,10.05
A4: length 83.1
  Top Layer w0.152: U4.66 14.47,39.28 v1(14.47,40.6) ; v1(13.4,16.04) 13.4,15.58 12.96,15.14 ; v1(35.09,37.06) 35.09,38.38 ; 6.99,26.1 8.26,26.1 8.57,25.79 v1(8.57,23.61)
  Bottom Layer w0.152: v1(14.47,40.6) 14.47,40.6 14.47,37.52 17.57,34.43 31.08,34.43 33.69,37.03 35.06,37.03 v1(35.09,37.06) 35.09,26.25 32.45,23.61 v1(8.57,23.61) 8.57,18.47 11.01,16.04 v1(13.4,16.04)
A4_EXT: length 8.3
  Top Layer w0.152: R8.2 12.91,13.58 12.91,9.43 13.08,8.93 14.27,7.71 15.68,6.54
A5: length 89.7
  Top Layer w0.152: v1(14.96,41.15) 14.96,39.3 U4.67 ; 35.59,38.38 35.59,36.52 v1(35.58,36.51) ; 14.14,11.66 14.11,11.69 v1(14.11,16.6) ; v1(9.13,23.1) 9.13,25.89 8.42,26.6 6.99,26.6
  Bottom Layer w0.152: v1(14.11,16.6) 11.31,16.6 9.13,18.78 v1(9.13,23.1) 32.75,23.1 35.58,25.93 v1(35.58,36.51) 35.58,37.29 35.22,37.65 33.6,37.65 30.78,34.83 17.82,34.83 14.96,37.69 v1(14.96,41.15)
A5_EXT: length 4.9
  Top Layer w0.152: 17.09,6.51 16.55,7.08 14.75,8.37 14.12,9.31 14.12,10.11
A6: length 86.5
  Top Layer w0.152: v1(15.48,40.62) 15.48,40.61 U4.68 ; v1(36.09,37.06) 36.09,37.07 36.09,38.38 ; R10.1 15.21,15.18 v1(15.21,17.06) ; 6.99,27.1 8.59,27.1 9.69,25.99 v1(9.69,22.64)
  Bottom Layer w0.152: v1(15.48,40.62) 15.48,37.75 17.98,35.25 30.5,35.25 33.35,38.09 35.5,38.09 36.09,37.5 v1(36.09,37.06) 36.09,25.67 33.06,22.64 v1(9.69,22.64) 9.69,18.98 11.61,17.06 v1(15.21,17.06)
A6_EXT: length 8.9
  Top Layer w0.152: R10.2 15.23,13.6 15.23,9.11 15.47,8.73 16.37,7.9 17.61,7.3 18.72,6.52
A7: length 93.6
  Top Layer w0.152: v1(36.58,36.51) 36.59,36.52 36.59,38.38 ; 15.98,41.18 U4.69 ; 6.99,27.6 8.8,27.6 10.2,26.2 v1(10.2,22.13) ; v1(16.4,17.52) 16.43,17.49 16.43,11.67 16.44,11.66
  Bottom Layer w0.152: v1(16.4,17.52) 11.97,17.52 10.2,19.29 v1(10.2,22.13) 33.26,22.13 36.58,25.45 v1(36.58,36.51) 36.58,37.66 35.73,38.5 33.11,38.5 30.26,35.65 18.15,35.65 15.98,37.82 v1(15.98,41.18)
A7_EXT: length 5.6
  Top Layer w0.152: 20.26,6.55 19.24,7.28 17.86,7.91 16.78,8.69 16.44,9.2 16.34,10.12
A8: length 95.2
  Top Layer w0.152: 17.55,14.73 17.51,14.77 v1(17.51,17.98) ; 6.99,32.6 9.38,32.6 11.11,30.87 v1(11.11,21.62) ; v1(37.08,37.06) 37.08,38.37 37.09,38.38 ; v1(16.47,40.62) 16.48,40.61 U4.70
  Bottom Layer w0.152: v1(16.47,40.62) 16.47,37.91 18.32,36.06 30.04,36.06 32.91,38.93 35.95,38.93 37.08,37.8 v1(37.08,37.06) 37.08,25.14 33.57,21.62 v1(11.11,21.62) 11.11,19.19 12.32,17.98 v1(17.51,17.98)
A8_EXT: length 9.4
  Top Layer w0.152: R12.2 17.56,13.62 17.56,9.82 17.65,9.34 18.19,8.64 19.46,7.88 20.78,7.24 21.86,6.56
A9: length 102.3
  Top Layer w0.152: 18.73,11.66 18.68,11.7 v1(18.68,18.43) ; v1(42.08,40.83) 42.09,40.82 42.09,38.38 ; v1(22.68,41.47) 20.68,41.47 ; 6.99,33.1 9.59,33.1 11.64,31.05 v1(11.64,21.12)
  Bottom Layer w0.152: v1(18.68,18.43) 12.58,18.43 11.64,19.37 v1(11.64,21.12) 33.67,21.12 39.36,26.81 39.36,37.32 42.08,40.04 v1(42.08,40.83) 42.08,41.86 41.34,42.6 25.22,42.6 24.09,41.47 v1(22.68,41.47)
A9_EXT: length 5.8
  Top Layer w0.152: 23.11,6.49 22.33,7.32 21.02,7.8 19.48,8.78 18.69,9.95
A10: length 81
  Top Layer w0.152: 20,33.1 v1(32.46,33.1) 33.07,33.71 39.51,33.71 42.59,36.79 42.59,41.48 v1(42.58,41.49) ; 19.85,14.71 19.85,23.25 22.14,25.54 31.18,25.54 31.49,25.85 v1(31.49,26.61) ; U4.78 20.7,41.99 v1(22.01,41.99)
  Bottom Layer w0.152: v1(22.01,41.99) 23.83,41.99 24.84,43.01 41.59,43.01 42.58,42.02 v1(42.58,41.49) ; v1(32.46,33.1) 31.48,32.13 31.48,26.61 v1(31.49,26.61)
A10_EXT: length 9.8
  Top Layer w0.152: R14.2 19.85,13.6 19.85,10.03 19.95,9.39 20.4,8.83 21.71,8.2 22.68,7.87 23.76,7.32 24.66,6.52
A11: length 106.4
  Top Layer w0.152: v1(12.23,20.6) 12.23,31.04 9.67,33.6 6.99,33.6 ; v1(22.07,43.47) 20.69,43.47 U4.81 ; v1(20.98,18.87) 21,18.85 21,11.68 21.02,11.66 ; 43.09,38.38 43.09,40.82 v1(43.08,40.83)
  Bottom Layer w0.152: v1(20.98,18.87) 20.96,18.89 12.93,18.89 12.23,19.59 v1(12.23,20.6) 12.24,20.61 33.82,20.61 39.82,26.6 39.82,37.12 43.08,40.38 v1(43.08,40.83) 43.08,42.1 41.76,43.42 22.12,43.42 v1(22.07,43.47)
A11_EXT: length 6.3
  Top Layer w0.152: 26.14,6.52 25.41,7.31 24.61,7.77 22.87,8.51 21.7,9.29 21.1,10.15
A12: length 91.3
  Top Layer w0.152: v1(43.58,41.49) 43.59,41.48 43.59,38.38 ; v1(12.89,20.15) 12.43,20.15 12.42,20.14 12.04,20.14 12.03,20.15 11.72,20.15 10.66,21.22 10.66,26.45 9.01,28.1 6.99,28.1 ; v1(22.58,43.97) 20.68,43.97 ; R16.1 31.2,15.04 v1(31.2,20.11)
  Bottom Layer w0.152: v1(12.89,20.15) 31.16,20.15 v1(31.2,20.11) 33.94,20.11 40.27,26.45 40.27,36.91 43.58,40.22 v1(43.58,41.49) 43.58,42.24 41.85,43.97 v1(22.58,43.97)
A12_EXT: length 7.4
  Top Layer w0.152: 30.98,13.18 29.92,10.53 28.76,7.87 28,6.42
A13: length 62.7
  Top Layer w0.152: R17.1 32.32,11.33 v1(32.32,15.12) ; 44.09,38.38 44.08,38.39 v1(44.08,40.83) ; U4.83 20.7,44.46 v1(22.06,44.46)
  Bottom Layer w0.152: v1(32.32,15.12) 32.32,17.85 40.73,26.26 40.73,36.61 44.08,39.96 v1(44.08,40.83) 44.08,42.35 41.97,44.46 v1(22.06,44.46)
A13_EXT: length 4.4
  Top Layer w0.152: 29.37,6.55 30.6,8.52 32.13,9.97
A14: length 62
  Top Layer w0.152: U4.89 20.69,47.48 v1(21.98,47.48) ; v1(33.46,15.61) 33.47,15.6 R18.1
  Bottom Layer w0.152: v1(33.46,15.61) 33.46,16.49 41.85,24.88 41.85,35.54 47.13,40.83 47.13,43.11 42.76,47.48 v1(21.98,47.48)
A14_EXT: length 7.9
  Top Layer w0.152: 30.96,6.45 32.47,8.2 33.24,9.4 33.49,10.75 33.49,13.53 R18.2
A15: length 65.9
  Top Layer w0.152: 34.64,11.61 34.63,11.62 v1(34.63,15.12) ; v1(22.54,47.99) 20.7,47.99 U4.90
  Bottom Layer w0.152: v1(22.54,47.99) 42.91,47.99 47.59,43.32 47.59,40.57 42.36,35.34 42.36,24.57 34.63,16.85 v1(34.63,15.12)
A15_EXT: length 4
  Top Layer w0.152: 32.44,6.61 33.71,8.34 34.23,9.14 34.41,10.04
BAT+: length 66.7
  Top Layer w0.508: R2.1 3.79,38.04 6.39,35.44 22.7,35.44 25.13,37.88 25.13,47.38 24.43,48.08 24.37,50.01 ; 24.37,50.01 BT1.1 ; 24.37,50.01 24.37,51.08 31.08,57.79 40.12,57.79 46.12,51.8 BT1.1
BATQ1: length 3.3
  Top Layer w0.305: Q1.3 4.05,35.75 3.14,36.66 3.14,37.28 R2.2
CLK: length 39.3
  Top Layer w0.152: R28.1 3.77,16.23 v1(3.34,16.66) ; 6.88,48.99 5.3,48.99 U4.34
  Bottom Layer w0.152: 6.88,48.99 5.72,48.99 1.56,44.84 1.56,30.82 2.94,29.45 2.94,17.07 v1(3.34,16.66)
  vias: v1(6.87,48.99)
CLK_EXT: length 7.8
  Top Layer w0.152: 3.83,5.85 3.83,13.57 R28.2
CS: length 38.8
  Top Layer w0.152: v1(7.43,45.46) 7.42,45.47 U4.41 ; v1(7.28,15.02) 7.28,11.68 7.27,11.66
  Bottom Layer w0.152: v1(7.43,45.46) 6.66,45.46 4.48,43.29 4.48,34.3 6.34,32.44 6.34,15.97 v1(7.28,15.02)
CS_EXT: length 3.5
  Top Layer w0.152: 8.24,6.6 7.28,10
D0: length 47.7
  Top Layer w0.152: 36.1,18.31 36.1,14.99 35.84,14.99 R20.1 ; v1(18.23,28.58) 18.71,28.1 34.81,28.1 36.09,26.83 36.09,18.34 ; U4.52 v1(7.48,37.78)
  Bottom Layer w0.152: v1(18.23,28.58) 16.24,28.58 10.35,34.48 9.28,34.48 7.48,36.28 v1(7.48,37.78)
D0_EXT: length 7.6
  Top Layer w0.152: 33.94,6.45 34.75,7.61 35.43,8.84 35.76,9.74 35.76,13.55 R20.2
D1: length 52.6
  Top Layer w0.152: v1(7.98,37.12) 7.98,39.27 U4.53 ; R21.1 37.1,11.46 37.1,18.31 ; 20,28.6 v1(21.19,28.6) 35.08,28.6 37.08,26.59 37.08,18.34
  Bottom Layer w0.152: v1(7.98,37.12) 7.98,36.38 9.42,34.93 10.5,34.93 16.39,29.05 20.74,29.05 v1(21.19,28.6)
D1_EXT: length 3.9
  Top Layer w0.152: 35.5,6.55 36.35,8.31 36.78,9.16 36.94,10.12
D2: length 49.7
  Top Layer w0.152: 20,29.1 v1(21.77,29.1) 35.34,29.1 38.09,26.35 38.09,18.34 ; v1(8.47,37.77) 8.47,39.26 U4.54 ; R22.1 38.1,15.03 38.1,18.31
  Bottom Layer w0.152: v1(21.77,29.1) 21.38,29.5 16.6,29.5 10.71,35.39 9.54,35.39 8.47,36.46 v1(8.47,37.77)
D2_EXT: length 7.3
  Top Layer w0.152: 37.07,6.47 37.92,8.12 38.12,8.96 38.12,13.5 R22.2
D3: length 54.1
  Top Layer w0.152: v1(8.97,37.12) 8.97,39.27 U4.55 ; 39.1,18.31 39.1,11.44 R23.1 ; 39.09,18.64 39.09,26.16 35.15,30.1 v1(22.37,30.1) 20,30.1
  Bottom Layer w0.152: v1(22.37,30.1) 16.66,30.1 10.91,35.85 9.69,35.85 8.97,36.56 v1(8.97,37.12)
D3_EXT: length 3.8
  Top Layer w0.152: 38.43,6.43 38.99,7.96 39.22,10.12
D4: length 52
  Top Layer w0.152: 20,30.6 v1(22.86,30.6) 36.68,30.6 40.58,26.7 40.58,18.65 40.59,18.64 ; 40.36,15.1 40.6,15.34 40.6,18.31 ; U4.56 9.46,39.25 v1(9.46,37.78)
  Bottom Layer w0.152: v1(9.46,37.78) 9.46,36.79 9.95,36.3 11.17,36.3 16.87,30.6 v1(22.86,30.6)
D4_EXT: length 7.1
  Top Layer w0.152: R24.2 40.41,13.5 40.41,9.62 40.29,8.11 39.86,6.5
D5: length 56.1
  Top Layer w0.152: 41.59,18.64 41.59,26.5 37,31.1 v1(23.38,31.1) 20,31.1 ; v1(9.99,37.12) 9.98,37.12 U4.57 ; 41.6,18.31 41.6,11.67 41.53,11.61
  Bottom Layer w0.152: v1(23.38,31.1) 17.03,31.1 11.01,37.12 v1(9.99,37.12)
D5_EXT: length 3.7
  Top Layer w0.152: 41.39,6.28 41.39,9.97
D6: length 53.2
  Top Layer w0.152: U4.58 10.48,39.27 v1(10.48,37.78) ; 20,31.6 v1(23.9,31.6) 37.16,31.6 42.59,26.16 42.59,18.64 ; R26.1 42.6,15.01 42.6,18.31
  Bottom Layer w0.152: v1(10.48,37.78) 11.16,37.78 17.34,31.6 v1(23.9,31.6)
D6_EXT: length 7.5
  Top Layer w0.152: R26.2 42.82,13.39 42.82,6.11
D7: length 56.8
  Top Layer w0.152: 43.59,18.64 43.57,18.65 43.57,25.89 37.37,32.1 v1(24.47,32.1) 20,32.1 ; U4.61 v1(11.98,37.8) ; 43.6,18.31 43.6,11.53 R27.1
  Bottom Layer w0.152: v1(11.98,37.8) 17.68,32.1 v1(24.47,32.1)
D7_EXT: length 3.4
  Top Layer w0.152: 44.25,6.58 43.9,9.98
RAM_A13: length 18.7
  Top Layer w0.152: U4.40 5.29,45.97 v1(6.87,45.97) ; 6.99,32.1 5.97,32.1 v1(5.62,32.45)
  Bottom Layer w0.152: 6.89,45.97 6.5,45.97 4.05,43.52 4.05,34.02 v1(5.62,32.45)
RAM_A14: length 28.4
  Top Layer w0.152: U4.35 7.41,48.47 v1(7.43,48.49) ; 6.99,28.6 6.98,28.59 v1(4.89,28.59)
  Bottom Layer w0.152: 7.42,48.49 6.03,48.49 1.97,44.43 1.97,31.52 v1(4.89,28.59)
RAM_A15: length 24.7
  Top Layer w0.152: 6.99,30.6 4.9,30.6 v1(4.68,30.82) ; U4.37 7.41,47.47 v1(7.43,47.49)
  Bottom Layer w0.152: v1(4.68,30.82) 2.78,32.72 2.78,44.09 6.18,47.49 v1(7.43,47.49)
RAM_A16: length 25.7
  Top Layer w0.152: v1(5.09,29.41) 5.4,29.1 6.99,29.1 ; U4.36 5.31,48 v1(6.87,48)
  Bottom Layer w0.152: v1(6.87,48) 6.12,48 2.38,44.26 2.38,32.12 v1(5.09,29.41)
RAM_A17: length 20.3
  Top Layer w0.152: 6.99,29.6 v1(8.12,29.6) ; 6.89,44.98 5.29,44.98 U4.42
  Bottom Layer w0.152: 6.89,44.98 4.89,42.97 4.89,34.47 7.1,32.26 7.1,30.62 v1(8.12,29.6)
  vias: v1(6.87,44.98)
RAM_A18: length 21.9
  Top Layer w0.152: v1(7.43,46.49) 5.3,46.49 U4.39 ; v1(5.78,31.1) 6.99,31.1
  Bottom Layer w0.152: v1(5.78,31.1) 5.78,31.57 3.6,33.75 3.6,43.72 6.36,46.49 7.42,46.49
RAM_CS: length 54.1
  Top Layer w0.152: v1(15.84,34.73) 6.09,34.73 5.4,34.05 5.4,33.13 3.9,31.63 R1.1 ; v1(18.02,52.46) 20.67,52.46 U4.99 ; 20,32.6 v1(25,32.6) 26.52,32.6
  Bottom Layer w0.152: v1(25,32.6) 17.97,32.6 v1(15.84,34.73) 13.5,37.07 13.5,48.6 17.36,52.46 v1(18.02,52.46)
RD: length 92.2
  Top Layer w0.152: v1(34.41,27.47) 35.59,26.28 35.59,18.64 ; v1(19.2,50.48) 20.68,50.48 U4.95 ; 26.52,33.6 v1(25.47,33.6) 16.38,33.6 12.84,30.06 12.84,25.59 13.55,24.88 13.55,19.74 11.11,17.31 8.27,17.31 6.09,15.13 6.07,15.13 R30.1
  Bottom Layer w0.152: v1(34.41,27.47) 32.58,25.64 30.21,25.64 29.25,26.6 29.25,31.83 27.48,33.6 v1(25.47,33.6) 17.73,33.6 13.91,37.43 13.91,48.24 16.14,50.48 v1(19.2,50.48)
RD_EXT: length 7.3
  Top Layer w0.152: R30.2 6.08,13.62 6.08,9.57 6.7,6.42
ROM_A14: length 29.1
  Top Layer w0.152: v1(22.57,44.99) 22.55,44.97 U4.84 ; 44.59,38.38 v1(44.59,41.49)
  Bottom Layer w0.152: v1(22.57,44.99) 42.1,44.99 44.59,42.5 v1(44.59,41.49)
ROM_A15: length 29.8
  Top Layer w0.152: v1(45.08,40.83) 45.09,40.82 45.09,38.38 ; U4.85 20.69,45.47 v1(22.04,45.47)
  Bottom Layer w0.152: v1(22.04,45.47) 42.23,45.47 45.08,42.62 v1(45.08,40.83)
ROM_A16: length 30.6
  Top Layer w0.152: U4.86 20.69,45.98 v1(22.58,45.98) ; 45.59,38.38 45.59,41.48 v1(45.58,41.49)
  Bottom Layer w0.152: v1(22.58,45.98) 42.33,45.98 45.58,42.73 v1(45.58,41.49)
ROM_A17: length 57.4
  Top Layer w0.152: v1(43.02,28.03) 44.69,26.36 44.69,20.56 45.59,19.66 45.59,18.64 ; U4.91 20.7,48.49 v1(21.98,48.49)
  Bottom Layer w0.152: v1(43.02,28.03) 43.02,35.34 48.05,40.37 48.05,43.48 43.04,48.49 v1(21.98,48.49)
ROM_A18: length 31.4
  Top Layer w0.152: 37.59,38.38 37.58,38.37 v1(37.58,36.51) ; v1(16.98,41.18) U4.71
  Bottom Layer w0.152: v1(16.98,41.18) 16.98,37.99 18.51,36.47 29.82,36.47 32.69,39.34 36.17,39.34 37.58,37.93 v1(37.58,36.51)
ROM_A19: length 29.2
  Top Layer w0.152: U4.72 17.49,39.28 v1(17.49,40.62) ; 38.09,38.38 38.09,38.38 v1(38.09,37.06)
  Bottom Layer w0.152: v1(38.09,37.06) 38.09,38.01 36.35,39.74 32.42,39.74 29.55,36.87 18.67,36.87 17.49,38.06 v1(17.49,40.62)
ROM_A20: length 24.8
  Top Layer w0.152: v1(41.58,41.49) 41.59,41.48 41.59,38.38 ; U4.76 20.69,40.98 v1(22.01,40.98)
  Bottom Layer w0.152: v1(22.01,40.98) 24.36,40.98 25.58,42.2 40.87,42.2 v1(41.58,41.49)
ROM_A21: length 30.8
  Top Layer w0.152: v1(18.73,41.44) 18.98,41.18 U4.75 ; 41.09,38.38 41.09,39.98 v1(40.78,40.29)
  Bottom Layer w0.152: v1(40.78,40.29) 40.11,40.96 31.66,40.96 28.79,38.09 19.28,38.09 18.99,38.39 18.99,41.18 v1(18.73,41.44)
ROM_A22: length 29.4
  Top Layer w0.152: v1(17.98,41.18) 17.98,41.18 U4.73 ; v1(39.14,39.8) 39.59,39.35 39.59,38.38
  Bottom Layer w0.152: v1(17.98,41.18) 17.98,38.18 18.88,37.28 29.3,37.28 32.17,40.15 38.8,40.15 v1(39.14,39.8)
ROM_A23: length 31.6
  Top Layer w0.152: U4.87 22.03,46.47 v1(22.04,46.47) ; 46.09,38.15 v1(46.09,40.83)
  Bottom Layer w0.152: v1(46.09,40.83) 46.09,42.89 42.51,46.47 v1(22.04,46.47)
ROM_A24: length 32.4
  Top Layer w0.152: U4.88 v1(22.54,46.97) ; v1(46.57,41.49) 46.57,38.16 46.59,38.15
  Bottom Layer w0.152: v1(22.54,46.97) 42.66,46.97 46.57,43.06 v1(46.57,41.49)
ROM_CS: length 49.1
  Top Layer w0.152: v1(33.92,26.09) 34.59,25.43 34.59,18.64 ; U4.47 v1(6.59,42.47)
  Bottom Layer w0.152: v1(33.92,26.09) 33.01,25.18 30.01,25.18 27.17,28.02 16.23,28.02 10.18,34.07 9.12,34.07 7.03,36.16 7.03,38.72 8.22,39.91 8.22,42.2 7.94,42.47 v1(6.59,42.47)
RST: length 56.7
  Top Layer w0.152: 44.95,14.97 47.08,17.1 47.08,19.08 45.25,20.91 45.25,26.61 v1(38.75,33.11) ; v1(18.48,40.62) 18.48,40.62 U4.74
  Bottom Layer w0.152: v1(18.48,40.62) 18.48,38.27 19.07,37.68 29.06,37.68 31.93,40.55 39.29,40.55 40.07,39.78 40.07,38.95 38.75,37.63 v1(38.75,33.11)
RST_EXT: length 7.4
  Top Layer w0.152: R32.2 45.1,13.4 45.1,10.17 45.26,7.83 45.79,6.32
TCK: length 5.6
  Top Layer w0.152: U4.24 7.48,53.5 v1(7.46,53.48)
  Bottom Layer w0.152: v1(7.46,53.48) 7.46,57.44 XP1.5
TDI: length 6
  Top Layer w0.152: XP1.3 4.61,56.73 4.92,56.42 7.46,56.42 7.98,55.9 U4.23
TDO: length 6.2
  Top Layer w0.152: XP1.2 3.34,56.47 3.8,56.02 6.64,56.02 6.98,55.68 U4.25
TMS: length 8.6
  Top Layer w0.152: U4.22 v1(8.48,53.37)
  Bottom Layer w0.152: v1(8.48,53.37) 7.92,52.82 6.64,52.82 5.88,53.58 XP1.4
VMIX: length 11.2
  Top Layer w0.254: 6.99,30.1 6.97,30.12 3.87,30.12 3.75,30 3.75,30.16 R1.2
  Top Layer w0.305: R1.2 3.25,32.6 3.67,32.6 4.33,33.26 3.99,33.26 2.45,34.8 Q1.2
WR: length 83.9
  Top Layer w0.152: v1(9.69,31.6) 6.99,31.6 4.88,31.6 v1(4.85,31.63) ; v1(8.22,34.27) 39.36,34.27 40.59,35.51 40.59,38.38 ; 4.97,11.68 4.92,11.74 v1(4.92,15.53) ; v1(6.87,46.97) U4.38
  Bottom Layer w0.152: v1(9.69,31.6) 9.69,32.81 v1(8.22,34.27) ; v1(6.87,46.97) 6.24,46.97 3.19,43.93 3.19,33.29 v1(4.85,31.63) 5.22,31.26 5.22,29.92 5.54,29.6 5.54,28.6 4.92,27.97 v1(4.92,15.53)
WR_EXT: length 3.6
  Top Layer w0.152: 5.33,6.52 5.12,10.13

## Copper pours and planes (outline as drawn; the poured copper is in the pictures)
+5V on Top Layer: 0.49,24.23 2.98,24.23 2.98,6.56 0.49,6.56
GND on Top Layer: -0.98,60.64 52.57,60.64 52.57,-1.54 -0.98,-1.54
GND on Bottom Layer: -0.98,60.64 52.57,60.64 52.57,-1.54 -0.98,-1.54

Small or netless copper shapes (teardrops, artwork), in the pictures only: 483 on Top Layer, 157 on Bottom Layer

## Text on the board
Top Solder Mask Layer: TDO | TDI | TMS | TCK | GND | VCC | MAX v1.22 | ChisFlash-MBC5
Top Silkscreen Layer: SRAM&FRAM / 1M(128K) | MOS | Designed by mori | MAX v1.22 | ChisFlash-MBC5
